# EAGLE design RoasterInterface (EAGLE 6.5.0)
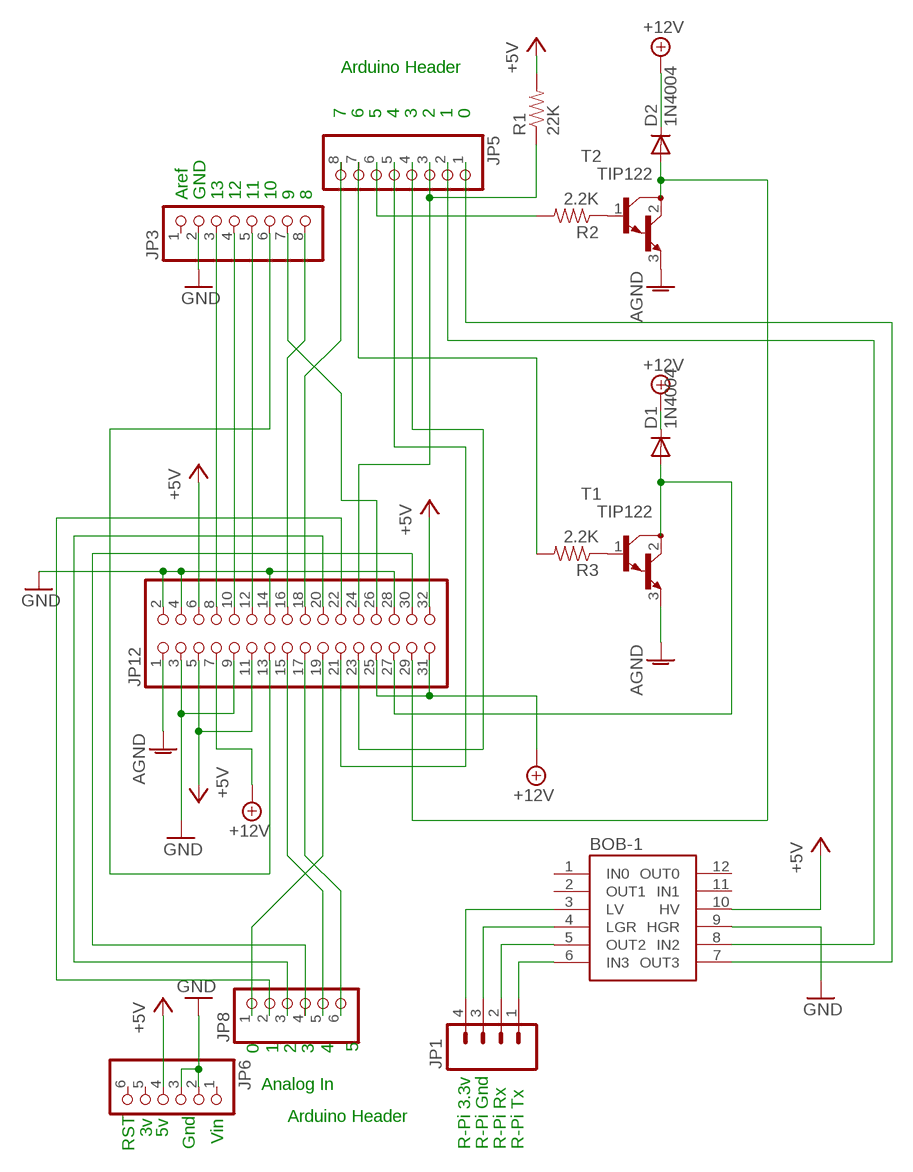
[diagram p0: schematic, sheet 1]

## Parts
BOB-1  BOB-08745DEFAULT  [5X6BOB]
D1  1N4004  [DO41-10]
D2  1N4004  [DO41-10]
JP1  M04LOCK  [1X04_LOCK]
JP3  PINHD-1X8CLEANBIG  [1X08-CLEANBIG]
JP5  PINHD-1X8CLEANBIG  [1X08-CLEANBIG]
JP6  PINHD-1X6CB  [1X06-CLEANBIG]
JP8  PINHD-1X6CB  [1X06-CLEANBIG]
JP12  PINHD-2X16  [2X16]
R1  22K  RESISTORPTH-1/4W  [AXIAL-0.4]
R2  2.2K  RESISTORPTH-1/4W  [AXIAL-0.4]
R3  2.2K  RESISTORPTH-1/4W  [AXIAL-0.4]
T1  TIP122  [TO220]
T2  TIP122  [TO220]

## Nets
+5V: BOB-1.10(HV) JP6.4 JP12.5 JP12.6 JP12.11 JP12.32 R1.P$2
+12V: D1.C D2.C JP12.7 JP12.25 JP12.31
AGND: JP12.1 T1.3(E) T2.3(E)
ARD-RX: BOB-1.7(OUT3) JP5.1
GND: BOB-1.9(HGR) JP3.2 JP6.2 JP6.3 JP12.2 JP12.3 JP12.4 JP12.9 JP12.14 JP12.28
N$1: R2.P$1 T2.1(B)
N$2: JP3.7 JP12.26
N$3: JP5.5 JP12.21
N$4: JP3.8 JP12.16
N$5: JP5.7 R3.P$2
N$6: JP5.8 JP12.18
N$7: JP3.5 JP12.12
N$8: JP3.6 JP12.13
N$9: JP5.6 R2.P$2
N$10: JP8.1 JP12.19
N$11: JP8.5 JP12.15
N$12: JP3.4 JP12.10
N$13: R3.P$1 T1.1(B)
N$14: JP3.3 JP12.8
N$15: JP8.6 JP12.17
N$16: JP8.2 JP12.22
N$17: JP8.3 JP12.20
N$18: JP8.4 JP12.30
N$19: JP5.3 JP12.24 R1.P$1
N$20: BOB-1.8(IN2) JP5.2
N$21: BOB-1.4(LGR) JP1.3
N$22: BOB-1.3(LV) JP1.4
N$23: BOB-1.5(OUT2) JP1.2
N$24: BOB-1.6(IN3) JP1.1
N$27: JP5.4 JP12.23
N$28: D2.A JP12.29 T2.2(C)
N$29: D1.A JP12.27 T1.2(C)
Unconnected: BOB-1.1(IN0) BOB-1.2(OUT1) BOB-1.11(IN1) BOB-1.12(OUT0) JP3.1 JP6.1 JP6.5 JP6.6

## Notes on the sheet
- Arduino Header
- 7 | 6 | 5 | 4 | 3 | 2 | 1 | 0
- Aref | GND | 13 | 12 | 11 | 10 | 9 | 8
- 0 | 1 | 2 | 3 | 4 | 5
- Analog In
- Arduino Header
- 3v | 5v
- Vin
- RST | Gnd | R-Pi 3.3v | R-Pi Gnd | R-Pi Rx | R-Pi Tx

## Library data of the parts
BOB-1 = Evan:BOB-08745
D1 D2 = diode:1N4004: DIODE general purpose rectifier, 1 A
JP1 = SparkFun:M04: Header 4 Standard 4-pin 0.1" header. Use with straight break away headers (SKU : PRT-00116), right angle break away headers (PRT-00553), swiss pins (PRT-00743), machine pins (PRT-00117), and female headers (PRT-00115). Molex polarized connector foot print use with SKU : PRT-08231 with associated crimp pins and housings. 1MM SMD Version SKU: PRT-10208
JP3 JP5 = carduino:PINHD-1X8: PIN HEADER
JP6 JP8 = carduino:PINHD-1X6: PIN HEADER
JP12 = pinhead:PINHD-2X16: PIN HEADER
R1-R3 = SparkFun:RESISTOR: Resistor Basic schematic elements and footprints for 0603, 1206, and PTH resistors.
T1 T2 = transistor:TIP122: NPN BIPOLAR DARLINGTON TRANSISTOR

## Board
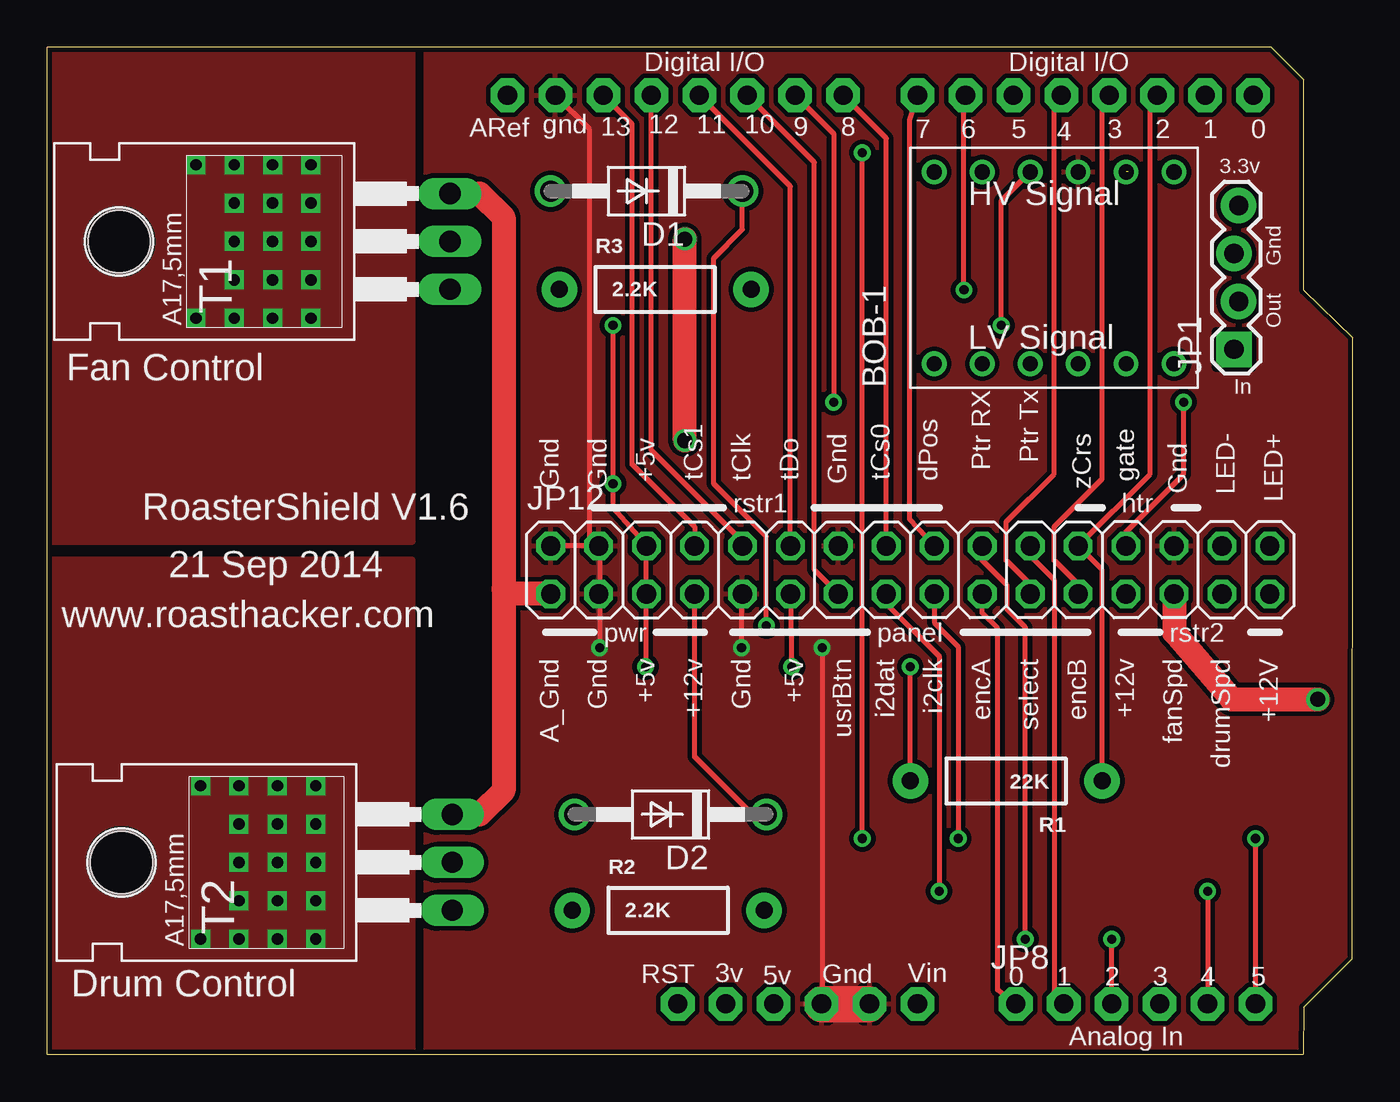
[diagram p1: board, top side]
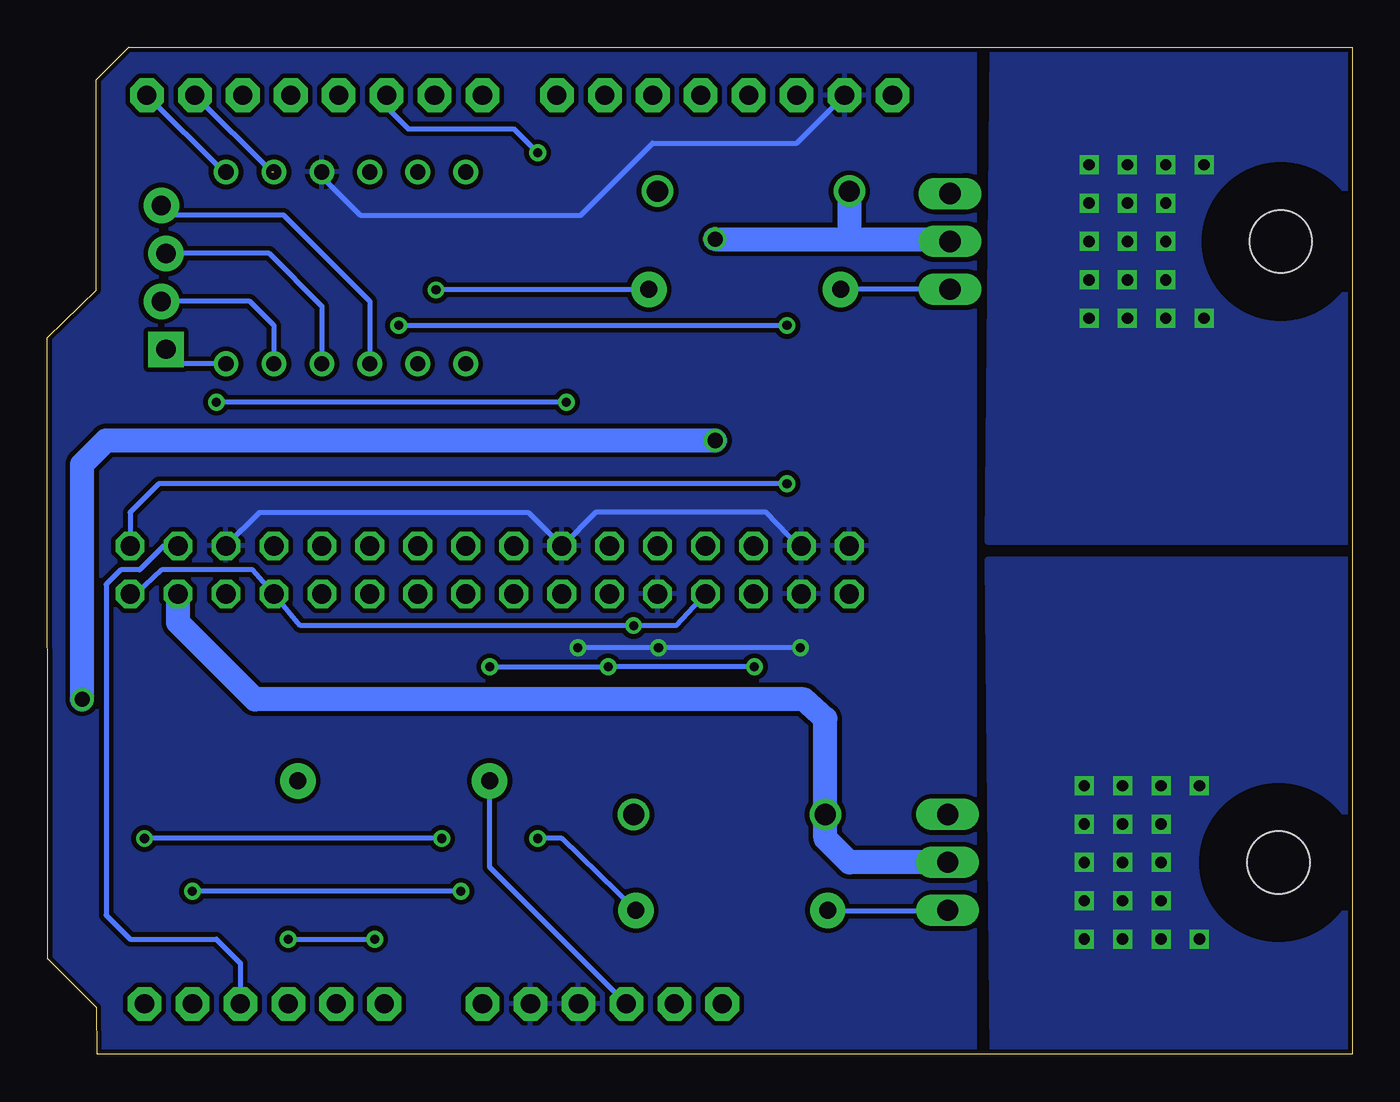
[diagram p2: board, bottom side, seen from below]

Size 69.16 x 53.35 mm. Coordinates in mm from the lower left corner, seen from the top.
Outline: 69.14,5.05 69.14,5.05
Outline: 69.14,5.05 69.16,37.95 66.56,40.49 66.56,51.63 64.83,53.35 0.01,53.35 0,0
Outline: 69.14,5.05 66.56,2.5 66.55,0.01 0,0.01
Copper layers (1*16): Top 0.035mm / dielectric 1.5mm / Bottom 0.035mm
Design rules "default": minimum track width 10mil, minimum drill 19mil, track to track 10mil, track to pad 10mil, pad to pad 10mil, via to via 10mil, smd to smd 0mil, copper to edge 10mil, drill to drill 8mil, minimum pad ring 10mil, minimum via ring 8mil, stop-mask expansion 4mil, vias tented up to drill 0mil, thermal gap 10mil

### Footprints (pad centres in the part's own frame; a part is rotated, then mirrored left to right if it is on the bottom)
5X6BOB = drill 0.8: 1 -5.08,6.35; 2 -5.08,3.81; 3 -5.08,1.27; 4 -5.08,-1.27; 5 -5.08,-3.81; 6 -5.08,-6.35; 7 5.08,-6.35; 8 5.08,-3.81; 9 5.08,-1.27; 10 5.08,1.27; 11 5.08,3.81; 12 5.08,6.35
DO41-10 = drill 1.118: A 5.08,0; C -5.08,0
1X04_LOCK = drill 1.016 pad 1.88 square: 1 0,0.127 | drill 1.016 pad 1.88: 2 2.54,-0.127; 3 5.08,0.127; 4 7.62,-0.127
1X08-CLEANBIG = drill 1.016 pad 1.778 octagon: 1 -8.89,0; 2 -6.35,0; 3 -3.81,0; 4 -1.27,0; 5 1.27,0; 6 3.81,0; 7 6.35,0; 8 8.89,0
1X06-CLEANBIG = drill 1.016 pad 1.778 octagon: 1 -6.35,0; 2 -3.81,0; 3 -1.27,0; 4 1.27,0; 5 3.81,0; 6 6.35,0
2X16 = drill 1.016 octagon: 1 -19.05,-1.27; 2 -19.05,1.27; 3 -16.51,-1.27; 4 -16.51,1.27; 5 -13.97,-1.27; 6 -13.97,1.27; 7 -11.43,-1.27; 8 -11.43,1.27; 9 -8.89,-1.27; 10 -8.89,1.27; 11 -6.35,-1.27; 12 -6.35,1.27; 13 -3.81,-1.27; 14 -3.81,1.27; 15 -1.27,-1.27; 16 -1.27,1.27; 17 1.27,-1.27; 18 1.27,1.27; 19 3.81,-1.27; 20 3.81,1.27; 21 6.35,-1.27; 22 6.35,1.27; 23 8.89,-1.27; 24 8.89,1.27; 25 11.43,-1.27; 26 11.43,1.27; 27 13.97,-1.27; 28 13.97,1.27; 29 16.51,-1.27; 30 16.51,1.27; 31 19.05,-1.27; 32 19.05,1.27
AXIAL-0.4 = drill 0.9 pad 1.88: P$1 -5.08,0; P$2 5.08,0
TO220 = drill 1.118 long: 1 -2.54,-6.35; 2 0,-6.35; 3 2.54,-6.35 | hole 3.302: 0,11.176

### Placement (x,y rotation side)
BOB-1  53.34,41.66 90 top
D1  31.75,45.73 180 top
D2  33.02,12.71 180 top
JP1  62.99,37.34 90 top
JP3  33.27,50.81 0 top
JP5  54.99,50.81 180 top
JP6  39.75,2.67 180 top
JP8  57.66,2.67 0 top
JP12  45.72,25.66 0 top
R1  50.8,14.48 180 top
R2  32.89,7.63 0 top
R3  32.21,40.52 0 top
T1  14.99,43.06 90 top
T2  15.11,10.17 90 top

### Tracks (layer width: path | path; a pad name or v marks a point on that pad's centre or on a via)
+5V  (via drill 0.48)
  Top 0.254: v39.45,20.53 39.42,24.24 JP12.11 | v31.7,20.53 31.7,24.24 JP12.5 31.7,24.44 31.7,26.88 JP12.6 29.97,28.96 v29.97,30.23 v29.97,38.61 | R1.P$2 v45.72,20.53 | v50.55,38.61 50.55,45.22 BOB-1.10
  Bottom 0.254: v31.7,20.53 v39.45,20.53 v45.72,20.53 | v50.55,38.61 v29.97,38.61 | JP6.4 45.72,9.91 R1.P$2 | v29.97,30.23 63.25,30.23 64.77,28.71 JP12.32
+12V  (via drill 0.48)
  Top 0.254: v38.1,22.71 38.1,27.44 35.31,30.23 35.31,42.17 36.83,43.69 D1.C | D2.C 37.34,12.71 34.29,15.75 JP12.7
  Bottom 0.254: JP12.7 35.87,22.71 v38.1,22.71 55.75,22.71 JP12.25 58.27,25.66 63.09,25.66 64.44,24.39 JP12.31 64.8,24.39
AGND
  Top 1.27: T1.3 21.46,45.6 22.9,45.61 24.18,44.34 24.18,24.64 | 24.18,24.64 24.18,13.98 22.91,12.71 T2.3 | JP12.1 24.43,24.39 24.18,24.64
ARD-RX
  Bottom 0.254: BOB-1.7 59.82,46.74 JP5.1
GND  (via drill 0.48)
  Top 0.254: 43.48,2.65 JP6.2 | 41.05,2.65 JP6.3 41.05,2.85 v41.05,21.54 | v36.78,21.54 36.78,24.24 JP12.9 | v29.26,21.54 29.26,24.24 JP12.3 29.26,24.44 29.26,26.88 JP12.4 28.7,26.93 | JP3.2 28.7,49.03 28.7,26.93 | 28.7,26.93 JP12.2
  Top 1.93: 41.05,2.65 43.48,2.65
  Bottom 0.254: JP12.4 29.26,26.88 29.31,26.88 31.06,28.71 40.11,28.71 41.88,26.9 JP12.14 43.69,28.71 57.91,28.71 JP12.28 | v29.26,21.54 v36.78,21.54 v41.05,21.54 | BOB-1.9 54.61,46.49 52.58,44.46 40.89,44.46 37.08,48.27 29.46,48.27 JP3.2
  pour Top: 20.07,53.35 20.07,0.01 66.55,0.01 66.55,2.55 69.09,5.09 69.09,38.11 66.55,40.65 66.55,51.82 65.02,53.35
  pour Bottom: 66.55,51.57 64.77,53.35 20.07,53.35 20.07,0.01 66.55,0.01 66.55,2.55 69.09,5.09 69.09,38.11 66.55,40.65
HEATSINK1  (via drill 0.6)
  other vias: 14.22,6.1 8.13,6.1 8.13,14.23 10.16,14.23 10.16,12.2 12.19,14.23 12.19,12.2 14.22,14.23 14.22,12.2 10.16,10.17 14.22,10.17 12.19,10.17 10.16,8.13 12.19,8.13 14.22,8.13 10.16,6.1 12.19,6.1
  pour Bottom: 0.25,26.17 19.3,26.17 19.05,0.01 0,0.01
  pour Top: 0.25,26.17 19.3,26.17 19.3,0.01 0,0.01
HEATSINK2  (via drill 0.6)
  other vias: 9.91,41.03 11.94,41.03 9.91,43.06 9.91,45.09 7.87,47.12 11.94,43.06 11.94,45.09 9.91,47.12 11.94,47.12 13.97,47.12 13.97,45.09 13.97,43.06 13.97,41.03 13.97,38.99 7.87,38.99 11.94,38.99 9.91,38.99
  pour Bottom: 0,53.35 0.25,27.18 19.3,27.18 19.05,53.35
  pour Top: 0.25,27.18 19.3,27.18 19.3,53.35 0,53.35
N$1
  Bottom 0.254: R2.P$1 27.64,7.57 21.54,7.57 T2.1
N$2  (via drill 0.48)
  Top 0.254: JP3.7 41.66,48.77 v41.66,34.55 | v60.2,34.55 60.2,30.74 57.15,27.69 JP12.26
  Bottom 0.254: v41.66,34.55 v60.2,34.55
N$3
  Top 0.254: JP12.21 52.07,24.9 50.8,26.17 50.8,28.2 53.34,30.74 53.34,50.42 JP5.5
N$4
  Top 0.254: JP12.16 44.45,48.52 JP3.8
N$5  (via drill 0.48)
  Top 0.254: v48.56,40.49 48.56,50.81 JP5.7
  Bottom 0.254: v48.56,40.49 37.72,40.49 R3.P$2
N$6
  Top 0.254: JP12.18 45.67,28.35 45.67,49.48 46.13,50.81 JP5.8
N$7
  Top 0.254: JP12.12 39.37,45.98 JP3.5
N$8
  Top 0.254: JP12.13 40.64,25.66 40.64,47.25 JP3.6
N$9  (via drill 0.48)
  Top 0.254: v43.18,11.44 v43.18,47.76
  Bottom 0.254: R2.P$2 41.91,11.44 v43.18,11.44 | v43.18,47.76 44.45,49.03 50.04,49.03 51.18,50.17 JP5.6
N$10
  Top 0.254: JP12.19 49.53,23.37 50.34,22.56 50.34,3.41 51.21,2.65 JP8.1
N$11  (via drill 0.48)
  Top 0.254: JP12.15 44.45,23.88 47.24,21.09 v47.24,8.64 | v61.47,8.64 JP8.5
  Bottom 0.254: v47.24,8.64 v61.47,8.64
N$12
  Top 0.254: JP12.10 36.83,27.18 32,32.01 JP3.4
N$13
  Bottom 0.254: T1.1 R3.P$1
N$14
  Top 0.254: JP3.3 30.99,49.28 30.99,31.25 34.29,27.95 JP12.8
N$15  (via drill 0.48)
  Top 0.254: JP12.17 46.99,22.87 48.26,21.6 v48.26,11.44 | 64.01,2.55 JP8.6 v64.01,11.44
  Bottom 0.254: v48.26,11.44 v64.01,11.44
N$16
  Top 0.254: JP12.22 52.07,26.42 53.34,25.15 53.34,3.31 JP8.2
N$17  (via drill 0.48)
  Top 0.254: JP8.3 v56.39,6.1 | v51.82,6.1 51.82,22.61 50.85,23.58 50.85,24.85 49.53,26.17 JP12.20
  Bottom 0.254: v56.39,6.1 v51.82,6.1
N$18
  Bottom 0.254: JP12.30 62.99,26.93 64.26,25.66 65.28,25.66 66.04,24.9 66.04,7.37 64.77,6.1 60.2,6.1 58.93,4.83 JP8.4
N$19
  Top 0.254: JP5.3 58.42,50.42 58.42,30.74 JP12.24 55.88,25.66 R1.P$1
N$20  (1 unrouted)
  Bottom 0.254: 57.28,46.74 JP5.2
N$21
  Bottom 0.254: JP1.3 57.4,42.42 54.61,39.63 BOB-1.4
N$22
  Bottom 0.254: JP1.4 62.61,44.46 56.64,44.46 52.07,39.88 BOB-1.3
N$23
  Bottom 0.254: JP1.2 58.42,39.88 57.15,38.61 BOB-1.5
N$24
  Bottom 0.254: JP1.1 62.1,36.58 BOB-1.6
N$27
  Top 0.254: JP12.23 54.61,24.9 53.34,26.17 53.34,27.95 55.88,30.49 55.88,50.17 JP5.4
N$28
  Bottom 1.27: T2.2 26.67,10.17 27.94,11.44 D2.A 27.94,17.79 29.08,18.8 58.17,18.8 62.23,22.87 JP12.29
N$29  (via drill 0.8)
  Top 1.27: JP12.27 59.69,22.36 62.74,18.8 v67.31,18.8 | v33.78,32.52 v33.78,43.19
  Bottom 1.27: v67.31,18.8 67.31,31.25 66.04,32.52 v33.78,32.52 | v33.78,43.19 26.67,43.19 | 26.67,43.19 21.46,43.19 T1.2 | D1.A 26.67,43.19

### Text on the board
tPlace: Digital I/O | Digital I/O | ARef | gnd | 13 | 12 | 11 | 10 | 9 | 8 | 7 | 6 | 5 | 3 | 2 | 1 | 0 | 4 | 3.3v | HV Signal | Gnd | Out | LV Signal | Fan Control | Ptr RX | Ptr Tx | In | dPos | Gnd | Gnd | +5v | tCs1 | tClk | tDo | Gnd | tCs0 | zCrs | gate | LED- | LED+ | Gnd | RoasterShield V1.6 | rstr1 | htr | 21 Sep 2014 | www.roasthacker.com | pwr | panel | rstr2 | A_Gnd | Gnd | +5v | +12v | Gnd | +5v | usrBtn | i2dat | i2clk | encA | select | encB | +12v | fanSpd | drumSpd | +12V | RST | 3v | 5v | Vin | Gnd | 0 | 1 | 2 | 3 | 4 | 5 | Drum Control | Analog In